# Altium schematic sheet Power.SchDoc
size A; SheetNumber: 2; SheetTotal: 4
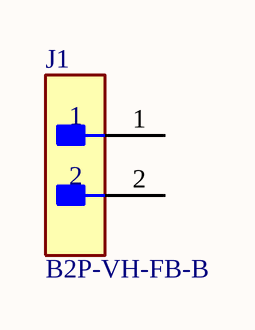
[diagram p0: Power.SchDoc]

## Parts
J1  B2P-VH-FB-B  [FP-B2P-VH-FB-B_LF_SN-MFG]

## Nets

Not connected (* = marked no-connect by the designer): J1 1 2

## Library data of the parts
J1 = CMP-002-00008-1: ShroudedHeader, 2Circuit, 3.96mmPitch; Green: Not Compliant; China RoHS Status: Unaffected; ELV: Not Compliant; EU SVHC List Version: Oct 28, 2008; Lead Free: Unknown; REACH(SVHC) Information: Unknown; RoHS Status: No; RoHS Version: 2011/65/EU, 2015/863